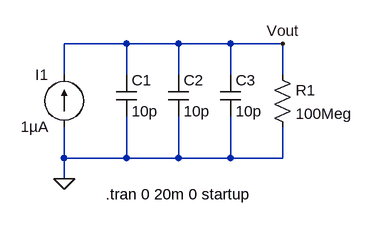
[diagram p0: schematic 2.1.6_Effect_of_Equivalent_Capacitance_in_wires.asc]
2.1.6_Effect_of_Equivalent_Capacitance_in_wires.asc, the LTspice schematic file:
Version 4
SHEET 1 880 680
WIRE 224 224 128 224
WIRE 304 224 224 224
WIRE 384 224 304 224
WIRE 464 224 384 224
WIRE 128 272 128 224
WIRE 224 272 224 224
WIRE 304 272 304 224
WIRE 384 272 384 224
WIRE 464 272 464 224
WIRE 128 400 128 352
WIRE 224 400 224 336
WIRE 224 400 128 400
WIRE 304 400 304 336
WIRE 304 400 224 400
WIRE 384 400 384 336
WIRE 384 400 304 400
WIRE 464 400 464 352
WIRE 464 400 384 400
WIRE 128 432 128 400
FLAG 128 432 0
FLAG 464 224 Vout
SYMBOL current 128 352 R180
WINDOW 0 24 80 Left 2
WINDOW 3 24 0 Left 2
SYMATTR InstName I1
SYMATTR Value 1µA
SYMBOL Cap 208 272 R0
SYMATTR InstName C1
SYMATTR Value 10p
SYMBOL Cap 288 272 R0
SYMATTR InstName C2
SYMATTR Value 10p
SYMBOL Cap 368 272 R0
SYMATTR InstName C3
SYMATTR Value 10p
SYMBOL Res 448 256 R0
SYMATTR InstName R1
SYMATTR Value 100Meg
TEXT 192 456 Left 2 !.tran 0 20m 0 startup

The netlist it stands for:
* 2.1.6_Effect_of_Equivalent_Capacitance_in_wires.asc
I1 0 Vout 1µA
C1 Vout 0 10p
C2 Vout 0 10p
C3 Vout 0 10p
R1 Vout 0 100Meg
.tran 0 20m 0 startup
.backanno
.end